# EAGLE design basisplatine (EAGLE 9.3.2)
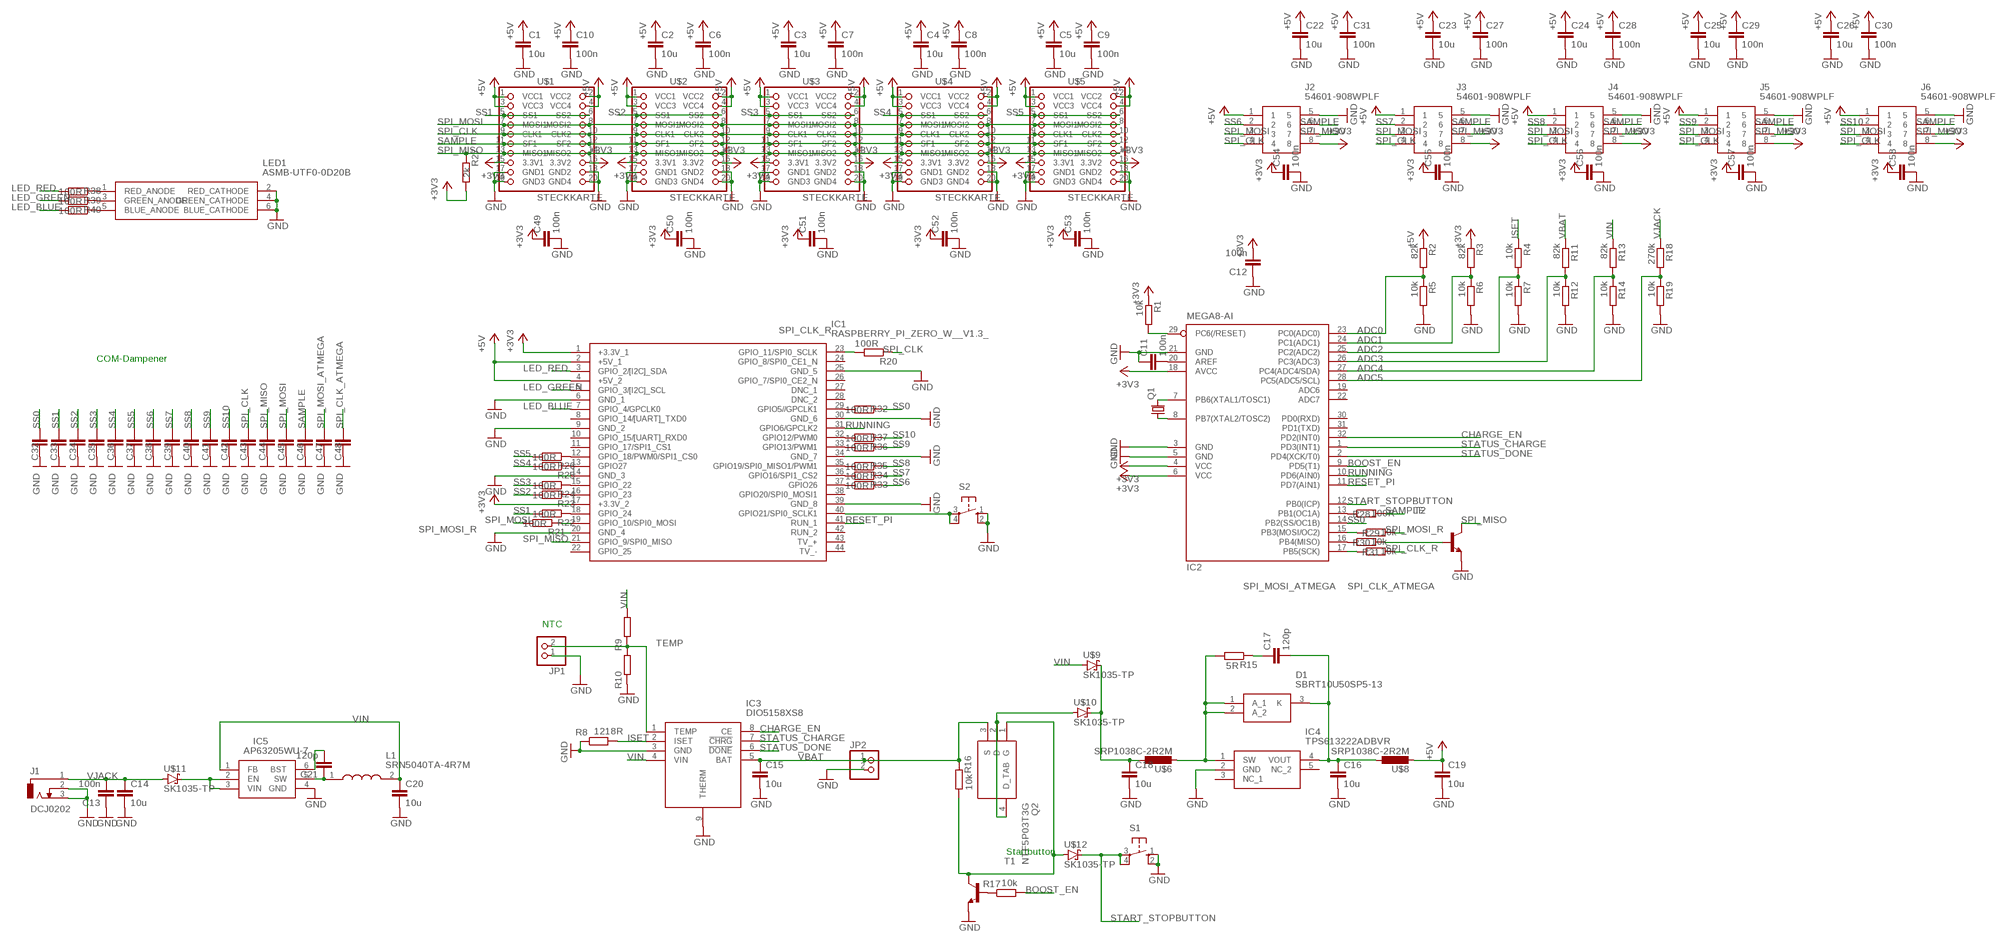
[diagram p0: schematic, sheet 1]

## Parts
C1  10u  C-EUC1206  [C1206]
C2  10u  C-EUC1206K  [C1206K]
C3  10u  C-EUC1206K  [C1206K]
C4  10u  C-EUC1206K  [C1206K]
C5  10u  C-EUC1206K  [C1206K]
C6  100n  C-EUC0603K  [C0603K]
C7  100n  C-EUC0603K  [C0603K]
C8  100n  C-EUC0603K  [C0603K]
C9  100n  C-EUC0603K  [C0603K]
C10  100n  C-EUC0603K  [C0603K]
C11  100n  C-EUC0603K  [C0603K]
C12  100n  C-EUC0603K  [C0603K]
C13  100n  C-EUC0603K  [C0603K]
C14  10u  C-EUC1206K  [C1206K]
C15  10u  C-EUC1206K  [C1206K]
C16  10u  C-EUC1206K  [C1206K]
C17  120p  C-EUC0603K  [C0603K]
C18  10u  C-EUC1206K  [C1206K]
C19  10u  C-EUC1206K  [C1206K]
C20  10u  C-EUC1206K  [C1206K]
C21  120p  C-EUC0603K  [C0603K]
C22  10u  C-EUC1206  [C1206]
C23  10u  C-EUC1206K  [C1206K]
C24  10u  C-EUC1206K  [C1206K]
C25  10u  C-EUC1206K  [C1206K]
C26  10u  C-EUC1206K  [C1206K]
C27  100n  C-EUC0603K  [C0603K]
C28  100n  C-EUC0603K  [C0603K]
C29  100n  C-EUC0603K  [C0603K]
C30  100n  C-EUC0603K  [C0603K]
C31  100n  C-EUC0603K  [C0603K]
C32  C-EUC0603K  [C0603K]
C33  C-EUC0603K  [C0603K]
C34  C-EUC0603K  [C0603K]
C35  C-EUC0603K  [C0603K]
C36  C-EUC0603K  [C0603K]
C37  C-EUC0603K  [C0603K]
C38  C-EUC0603K  [C0603K]
C39  C-EUC0603K  [C0603K]
C40  C-EUC0603K  [C0603K]
C41  C-EUC0603K  [C0603K]
C42  C-EUC0603K  [C0603K]
C43  C-EUC0603K  [C0603K]
C44  C-EUC0603K  [C0603K]
C45  C-EUC0603K  [C0603K]
C46  C-EUC0603K  [C0603K]
C47  C-EUC0603K  [C0603K]
C48  C-EUC0603K  [C0603K]
C49  100n  C-EUC0603K  [C0603K]
C50  100n  C-EUC0603K  [C0603K]
C51  100n  C-EUC0603K  [C0603K]
C52  100n  C-EUC0603K  [C0603K]
C53  100n  C-EUC0603K  [C0603K]
C54  100n  C-EUC0603K  [C0603K]
C55  100n  C-EUC0603K  [C0603K]
C56  100n  C-EUC0603K  [C0603K]
C57  100n  C-EUC0603K  [C0603K]
C58  100n  C-EUC0603K  [C0603K]
D1  SBRT10U50SP5-13  [SBRT10U50SP513]
IC1  RASPBERRY_PI_ZERO_W__V1.3_  [RASPBERRYPIZEROWV13]
IC2  MEGA8-AI  [TQFP32-08]
IC3  DIO5158XS8  [SOIC127P600X170-9N]
IC4  TPS613222ADBVR  [SOT95P280X145-5N]
IC5  AP63205WU-7  [SOT95P280X100-6N]
J1  DCJ0202  [DCJ0202]
J2  54601-908WPLF  [54601908WPLF]
J3  54601-908WPLF  [54601908WPLF]
J4  54601-908WPLF  [54601908WPLF]
J5  54601-908WPLF  [54601908WPLF]
J6  54601-908WPLF  [54601908WPLF]
JP1  PINHD-1X2  [1X02]
JP2  PINHD-1X2  [1X02]
L1  SRN5040TA-4R7M  [SRN5040TA4R7M]
LED1  ASMB-UTF0-0D20B  [ASMBUTF00D20B]
Q1  CRYSTALTC38H  [TC38H]
Q2  NTF5P03T3G  [SOT230P700X175-4N]
R1  10k  R-EU_R0603  [R0603]
R2  82k  R-EU_R0603  [R0603]
R3  82k  R-EU_R0603  [R0603]
R4  10k  R-EU_R0603  [R0603]
R5  10k  R-EU_R0603  [R0603]
R6  10k  R-EU_R0603  [R0603]
R7  10k  R-EU_R0603  [R0603]
R8  1218R  R-EU_R0603  [R0603]
R9  R-EU_R0603  [R0603]
R10  R-EU_R0603  [R0603]
R11  82k  R-EU_R0603  [R0603]
R12  10k  R-EU_R0603  [R0603]
R13  82k  R-EU_R0603  [R0603]
R14  10k  R-EU_R0603  [R0603]
R15  5R  R-EU_R0603  [R0603]
R16  10k  R-EU_R0603  [R0603]
R17  10k  R-EU_R0603  [R0603]
R18  270k  R-EU_R0603  [R0603]
R19  10k  R-EU_R0603  [R0603]
R20  100R  R-EU_R0603  [R0603]
R21  100R  R-EU_R0603  [R0603]
R22  100R  R-EU_R0603  [R0603]
R23  100R  R-EU_R0603  [R0603]
R24  100R  R-EU_R0603  [R0603]
R25  100R  R-EU_R0603  [R0603]
R26  100R  R-EU_R0603  [R0603]
R27  2k  R-EU_R0603  [R0603]
R28  100R  R-EU_R0603  [R0603]
R29  10k  R-EU_R0603  [R0603]
R30  10k  R-EU_R0603  [R0603]
R31  10k  R-EU_R0603  [R0603]
R32  100R  R-EU_R0603  [R0603]
R33  100R  R-EU_R0603  [R0603]
R34  100R  R-EU_R0603  [R0603]
R35  100R  R-EU_R0603  [R0603]
R36  100R  R-EU_R0603  [R0603]
R37  100R  R-EU_R0603  [R0603]
R38  100R  R-EU_R0603  [R0603]
R39  100R  R-EU_R0603  [R0603]
R40  100R  R-EU_R0603  [R0603]
S1  10-XX  [B3F-10XX]
S2  10-XX  [B3F-10XX]
T1  BC808-NPN-SOT23-BEC  [SOT23-BEC]
T2  BC808-NPN-SOT23-BEC  [SOT23-BEC]
U$1  STECKKARTE  [2X10]
U$2  STECKKARTE  [2X10]
U$3  STECKKARTE  [2X10]
U$4  STECKKARTE  [2X10]
U$5  STECKKARTE  [2X10]
U$6  SRP1038C-2R2M  [SRP1038C-2R2M]
U$8  SRP1038C-2R2M  [SRP1038C-2R2M]
U$9  SK1035-TP  [INDC2520X120N]
U$10  SK1035-TP  [INDC2520X120N]
U$11  SK1035-TP  [INDC2520X120N]
U$12  SK1035-TP  [INDC2520X120N]

## Nets
+3V3: C12.2 C49.1 C50.1 C51.1 C52.1 C53.1 C54.1 C55.1 C56.1 C57.1 C58.1 IC1.1(+3.3V_1) IC1.17(+3.3V_2) IC2.4(VCC) IC2.6(VCC) IC2.18(AVCC) J2.8 J3.8 J4.8 J5.8 J6.8 R1.1 R3.1 R27.2 U$1.15(3.3V1) U$1.16(3.3V2) U$2.15(3.3V1) U$2.16(3.3V2) U$3.15(3.3V1) U$3.16(3.3V2) U$4.15(3.3V1) U$4.16(3.3V2) U$5.15(3.3V1) U$5.16(3.3V2)
+5V: C1.1 C2.1 C3.1 C4.1 C5.1 C6.1 C7.1 C8.1 C9.1 C10.1 C19.1 C22.1 C23.1 C24.1 C25.1 C26.1 C27.1 C28.1 C29.1 C30.1 C31.1 IC1.2(+5V_1) IC1.4(+5V_2) J2.1 J3.1 J4.1 J5.1 J6.1 R2.1 U$1.1(VCC1) U$1.2(VCC2) U$1.3(VCC3) U$1.4(VCC4) U$2.1(VCC1) U$2.2(VCC2) U$2.3(VCC3) U$2.4(VCC4) U$3.1(VCC1) U$3.2(VCC2) U$3.3(VCC3) U$3.4(VCC4) U$4.1(VCC1) U$4.2(VCC2) U$4.3(VCC3) U$4.4(VCC4) U$5.1(VCC1) U$5.2(VCC2) U$5.3(VCC3) U$5.4(VCC4) U$8.P$2
ADC0: IC2.23(PC0(ADC0)) R2.2 R5.1
ADC1: IC2.24(PC1(ADC1)) R3.2 R6.1
ADC2: IC2.25(PC2(ADC2)) R4.2 R7.1
ADC3: IC2.26(PC3(ADC3)) R11.2 R12.1
ADC4: IC2.27(PC4(ADC4/SDA)) R13.2 R14.1
ADC5: IC2.28(PC5(ADC5/SCL)) R18.2 R19.1
BOOST_EN: IC2.9(PD5(T1)) R17.2
CHARGE_EN: IC2.32(PD2(INT0)) IC3.8(CE)
CLOCK_EN: IC2.29(PC6(/RESET)) R1.2
GND: C1.2 C2.2 C3.2 C4.2 C5.2 C6.2 C7.2 C8.2 C9.2 C10.2 C11.1 C12.1 C13.1 C14.2 C15.2 C16.2 C18.2 C19.2 C20.2 C22.2 C23.2 C24.2 C25.2 C26.2 C27.2 C28.2 C29.2 C30.2 C31.2 C32.1 C33.1 C34.1 C35.1 C36.1 C37.1 C38.1 C39.1 C40.1 C41.1 C42.1 C43.1 C44.1 C45.1 C46.1 C47.1 C48.1 C49.2 C50.2 C51.2 C52.2 C53.2 C54.2 C55.2 C56.2 C57.2 C58.2 IC1.6(GND_1) IC1.9(GND_2) IC1.14(GND_3) IC1.20(GND_4) IC1.25(GND_5) IC1.30(GND_6) IC1.34(GND_7) IC1.39(GND_8) IC2.3(GND) IC2.5(GND) IC2.21(GND) IC3.3(GND) IC3.9(THERM) IC4.2(GND) IC5.4(GND) J1.2 J1.3 J2.5 J3.5 J4.5 J5.5 J6.5 JP1.1 JP2.2 LED1.2(RED_CATHODE) LED1.4(GREEN_CATHODE) LED1.6(BLUE_CATHODE) R5.2 R6.2 R7.2 R8.1 R10.1 R12.2 R14.2 R19.2 S1.1(S) S1.2(S1) S2.1(S) S2.2(S1) T1.E T2.E U$1.17(GND1) U$1.18(GND2) U$1.19(GND3) U$1.20(GND4) U$2.17(GND1) U$2.18(GND2) U$2.19(GND3) U$2.20(GND4) U$3.17(GND1) U$3.18(GND2) U$3.19(GND3) U$3.20(GND4) U$4.17(GND1) U$4.18(GND2) U$4.19(GND3) U$4.20(GND4) U$5.17(GND1) U$5.18(GND2) U$5.19(GND3) U$5.20(GND4)
ISET: IC3.2(ISET) R4.1 R8.2
LED_BLUE: IC1.7(GPIO_4/GPCLK0) R40.2
LED_GREEN: IC1.5(GPIO_3/[I2C]_SCL) R39.2
LED_RED: IC1.3(GPIO_2/[I2C]_SDA) R38.2
N$1: D1.1(A_1) D1.2(A_2) IC4.1(SW) R15.2 U$6.P$2
N$2: C11.2 IC2.20(AREF)
N$3: IC2.7(PB6(XTAL1/TOSC1)) Q1.2
N$4: IC2.8(PB7(XTAL2/TOSC2)) Q1.1
N$5: IC5.2(EN) IC5.3(VIN) U$11.2(C)
N$6: C21.1 IC5.5(SW) L1.1
N$7: C17.1 R15.1
N$8: C16.1 C17.2 D1.3(K) IC4.4(VOUT) U$8.P$1
N$9: C18.1 U$6.P$1 U$9.2(C) U$10.2(C)
N$11: R17.1 T1.B
N$12: Q2.2(D) Q2.4(D_TAB) U$10.1(A)
N$13: C21.2 IC5.6(BST)
N$14: R30.2 T2.B
N$15: IC1.18(GPIO_24) R22.1
N$16: IC1.16(GPIO_23) R23.1
N$17: IC1.15(GPIO_22) R24.1
N$18: IC1.13(GPIO27) R25.1
N$19: IC1.12(GPIO_18/PWM0/SPI1_CS0) R26.1
N$20: IC2.13(PB1(OC1A)) R28.1
N$21: IC1.40(GPIO21/SPI0_SCLK1) S2.3(P) S2.4(P1)
N$22: IC2.16(PB4(MISO)) R30.1
N$23: Q2.1(G) R16.2 T1.C U$12.1(A)
N$24: IC1.29(GPIO5//GPCLK1) R32.2
N$25: IC1.32(GPIO12/PWM0) R37.2
N$26: IC1.33(GPIO13/PWM1) R36.2
N$27: IC1.35(GPIO19/SPI0_MISO1/PWM1) R35.2
N$28: IC1.36(GPIO16/SPI1_CS2) R34.2
N$29: IC1.37(GPIO26) R33.2
N$30: LED1.1(RED_ANODE) R38.1
N$31: LED1.3(GREEN_ANODE) R39.1
N$32: LED1.5(BLUE_ANODE) R40.1
RESET_PI: IC1.41(RUN_1) IC2.11(PD7(AIN1))
RUNNING: IC1.31(GPIO6/GPCLK2) IC2.10(PD6(AIN0))
SAMPLE: C46.2 J2.6 J3.6 J4.6 J5.6 J6.6 R28.2 U$1.11(SF1) U$1.12(SF2) U$2.11(SF1) U$2.12(SF2) U$3.11(SF1) U$3.12(SF2) U$4.11(SF1) U$4.12(SF2) U$5.11(SF1) U$5.12(SF2)
SPI_CLK: C43.2 J2.4 J3.4 J4.4 J5.4 J6.4 R20.1 U$1.9(CLK1) U$1.10(CLK2) U$2.9(CLK1) U$2.10(CLK2) U$3.9(CLK1) U$3.10(CLK2) U$4.9(CLK1) U$4.10(CLK2) U$5.9(CLK1) U$5.10(CLK2)
SPI_CLK_ATMEGA: C48.2 IC2.17(PB5(SCK)) R31.1
SPI_CLK_R: IC1.23(GPIO_11/SPI0_SCLK) R20.2 R31.2
SPI_MISO: C44.2 IC1.21(GPIO_9/SPI0_MISO) J2.7 J3.7 J4.7 J5.7 J6.7 R27.1 T2.C U$1.13(MISO1) U$1.14(MISO2) U$2.13(MISO1) U$2.14(MISO2) U$3.13(MISO1) U$3.14(MISO2) U$4.13(MISO1) U$4.14(MISO2) U$5.13(MISO1) U$5.14(MISO2)
SPI_MOSI: C45.2 J2.3 J3.3 J4.3 J5.3 J6.3 R21.2 U$1.7(MOSI1) U$1.8(MOSI2) U$2.7(MOSI1) U$2.8(MOSI2) U$3.7(MOSI1) U$3.8(MOSI2) U$4.7(MOSI1) U$4.8(MOSI2) U$5.7(MOSI1) U$5.8(MOSI2)
SPI_MOSI_ATMEGA: C47.2 IC2.15(PB3(MOSI/OC2)) R29.1
SPI_MOSI_R: IC1.19(GPIO_10/SPI0_MOSI) R21.1 R29.2
SS0: C32.2 IC2.14(PB2(SS/OC1B)) R32.1
SS1: C33.2 R22.2 U$1.5(SS1) U$1.6(SS2)
SS2: C34.2 R23.2 U$2.5(SS1) U$2.6(SS2)
SS3: C35.2 R24.2 U$3.5(SS1) U$3.6(SS2)
SS4: C36.2 R25.2 U$4.5(SS1) U$4.6(SS2)
SS5: C37.2 R26.2 U$5.5(SS1) U$5.6(SS2)
SS6: C38.2 J2.2 R33.1
SS7: C39.2 J3.2 R34.1
SS8: C40.2 J4.2 R35.1
SS9: C41.2 J5.2 R36.1
SS10: C42.2 J6.2 R37.1
START_STOPBUTTON: IC2.12(PB0(ICP)) S1.3(P) S1.4(P1) U$12.2(C)
STATUS_CHARGE: IC2.1(PD3(INT1)) IC3.7(!CHRG)
STATUS_DONE: IC2.2(PD4(XCK/T0)) IC3.6(!DONE)
TEMP: IC3.1(TEMP) JP1.2 R9.1 R10.2
VBAT: C15.1 IC3.5(BAT) JP2.1 Q2.3(S) R11.1 R16.1
VIN: C20.1 IC3.4(VIN) IC5.1(FB) L1.2 R9.2 R13.1 U$9.1(A)
VJACK: C13.2 C14.1 J1.1 R18.1 U$11.1(A)
Unconnected: IC1.8(GPIO_14/[UART]_TXD0) IC1.10(GPIO_15/[UART]_RXD0) IC1.11(GPIO_17/SPI1_CS1) IC1.22(GPIO_25) IC1.24(GPIO_8/SPI0_CE1_N) IC1.26(GPIO_7/SPI0_CE2_N) IC1.27(DNC_1) IC1.28(DNC_2) IC1.38(GPIO20/SPI0_MOSI1) IC1.42(RUN_2) IC1.43(TV_+) IC1.44(TV_-) IC2.19(ADC6) IC2.22(ADC7) IC2.30(PD0(RXD)) IC2.31(PD1(TXD)) IC4.3(NC_1) IC4.5(NC_2)

## Notes on the sheet
- COM-Dampener
- NTC
- Startbutton

## Library data of the parts
C1-C58 = rcl:C-EU: CAPACITOR, European symbol; SPICEPREFIX: C
D1 = basisplatine_lib:SBRT10U50SP5-13: Diodes Inc 50V 10A, Diode, 3-Pin PowerDI 5 SBRT10U50SP5-13 Source: Datasheet <https://componentsearchengine.com/Datasheets/1/SBRT10U50SP5-13.pdf>; DESCRIPTION: Diodes Inc 50V 10A, Diode, 3-Pin PowerDI 5 SBRT10U50SP5-13; HEIGHT: 1.15mm; MANUFACTURER_NAME: Diodes Inc.; MANUFACTURER_PART_NUMBER: SBRT10U50SP5-13; MOUSER_PART_NUMBER: 621-SBRT10U50SP5-13; MOUSER_PRICE-STOCK: https://www.mouser.com/Search/Refine.aspx?Keyword=621-SBRT10U50SP5-13
IC1 = basisplatine_lib:RASPBERRY_PI_ZERO_W__V1.3_: Raspberry Pi Zero W (v1.3) Single-board Computers Source: Datasheet <https://cdn.sparkfun.com/assets/learn_tutorials/6/7/6/PiZero_1.pdf>; DESCRIPTION: Raspberry Pi Zero W (v1.3) Single-board Computers; HEIGHT: mm; MANUFACTURER_NAME: RASPBERRY-PI; MANUFACTURER_PART_NUMBER: Raspberry Pi Zero W (v1.3)
IC2 = atmel:MEGA8: MICROCONTROLLER 8 Kbytes FLASH, 1 kbytes SRAM, 512 bytes EEPROM, USART, 6-channel 10 bit ADC, 2-channel 8 bit ADC Pin compatible with Atmega48, ATMega88, ATMega168 Source: avr.lbr; MPN: ATMEGA8-16AU; OC_FARNELL: 9171371; OC_NEWARK: 73M8863
IC3 = basisplatine_lib:DIO5158XS8: Battery Management 1A Lithium Ion Battery Charger IC Source: Datasheet <https://componentsearchengine.com/Datasheets/1/DIO5158XS8.pdf>; DESCRIPTION: Battery Management 1A Lithium Ion Battery Charger IC; HEIGHT: 1.7mm; MANUFACTURER_NAME: DIOO Microcircuits; MANUFACTURER_PART_NUMBER: DIO5158XS8; MOUSER_PART_NUMBER: 453-DIO5158XS8; MOUSER_PRICE-STOCK: https://www.mouser.com/Search/Refine.aspx?Keyword=453-DIO5158XS8
IC4 = basisplatine_lib:TPS613222ADBVR: 6-uA Quiescent Current, 1.8-A Switch Current Boost Converter Source: Datasheet <http://www.ti.com/lit/gpn/tps61322>; DESCRIPTION: 6-uA Quiescent Current, 1.8-A Switch Current Boost Converter; HEIGHT: 1.45mm; MANUFACTURER_NAME: Texas Instruments; MANUFACTURER_PART_NUMBER: TPS613222ADBVR; MOUSER_PART_NUMBER: 595-TPS613222ADBVR; MOUSER_PRICE-STOCK: https://www.mouser.com/Search/Refine.aspx?Keyword=595-TPS613222ADBVR
IC5 = basisplatine_lib:AP63205WU-7: Switching Voltage Regulators DCDC Conv HV Buck TSOT26 T&R 3K Source: Datasheet <https://componentsearchengine.com/Datasheets/1/AP63205WU-7.pdf>; DESCRIPTION: Switching Voltage Regulators DCDC Conv HV Buck TSOT26 T&R 3K; HEIGHT: 1mm; MANUFACTURER_NAME: Diodes Inc.; MANUFACTURER_PART_NUMBER: AP63205WU-7; MOUSER_PART_NUMBER: 621-AP63205WU-7; MOUSER_PRICE-STOCK: https://www.mouser.com/Search/Refine.aspx?Keyword=621-AP63205WU-7
J1 = con-jack:DCJ0202: DC POWER JACK Source: DCJ0202.pdf; OC_FARNELL: unknown; OC_NEWARK: unknown
J2-J6 = basisplatine_lib:54601-908WPLF: Modular Connectors / Ethernet Connectors 8P8C CAT 3 MOD JACK HORIZ. 1 PORT Source: Datasheet <https://www.amphenol-icc.com/media/wysiwyg/files/drawing/c-bmj-0051.pdf>; DESCRIPTION: Modular Connectors / Ethernet Connectors 8P8C CAT 3 MOD JACK HORIZ. 1 PORT; HEIGHT: 11.6mm; MANUFACTURER_NAME: Amphenol; MANUFACTURER_PART_NUMBER: 54601-908WPLF; MOUSER_PART_NUMBER: 649-54601-908WPLF; MOUSER_PRICE-STOCK: https://www.mouser.com/Search/Refine.aspx?Keyword=649-54601-908WPLF
JP1 JP2 = pinhead:PINHD-1X2: PIN HEADER
L1 = basisplatine_lib:SRN5040TA-4R7M: Inductor SMD 4.95x4.95x3.9mm 4.7uH 3.2A Source: Datasheet <https://componentsearchengine.com/Datasheets/1/SRN5040TA-4R7M.pdf>; DESCRIPTION: Inductor SMD 4.95x4.95x3.9mm 4.7uH 3.2A; HEIGHT: 4.1mm; MANUFACTURER_NAME: Bourns; MANUFACTURER_PART_NUMBER: SRN5040TA-4R7M; MOUSER_PART_NUMBER: 652-SRN5040TA-4R7M; MOUSER_PRICE-STOCK: https://www.mouser.com/Search/Refine.aspx?Keyword=652-SRN5040TA-4R7M
LED1 = basisplatine_lib:ASMB-UTF0-0D20B: Standard LEDs - SMD 2828 Tricolor PLCC6 LEDs Source: Datasheet <https://docs.broadcom.com/docs/ASMB-UTF0-0D20B-DS100>; DESCRIPTION: Standard LEDs - SMD 2828 Tricolor PLCC6 LEDs; HEIGHT: 2.6mm; MANUFACTURER_NAME: Avago Technologies; MANUFACTURER_PART_NUMBER: ASMB-UTF0-0D20B; MOUSER_PART_NUMBER: 630-ASMB-UTF0-0D20B; MOUSER_PRICE-STOCK: https://www.mouser.com/Search/Refine.aspx?Keyword=630-ASMB-UTF0-0D20B
Q1 = crystal:CRYSTAL: CRYSTAL; OC_FARNELL: unknown; OC_NEWARK: unknown
Q2 = basisplatine_lib:NTF5P03T3G: Power MOSFET Source: Datasheet <https://componentsearchengine.com/Datasheets/1/NTF5P03T3G.pdf>; DESCRIPTION: Power MOSFET; HEIGHT: 1.75mm; MANUFACTURER_NAME: ON Semiconductor; MANUFACTURER_PART_NUMBER: NTF5P03T3G; MOUSER_PART_NUMBER: 863-NTF5P03T3G; MOUSER_PRICE-STOCK: https://www.mouser.com/Search/Refine.aspx?Keyword=863-NTF5P03T3G
R1-R40 = rcl:R-EU_: RESISTOR, European symbol; SPICEPREFIX: R
S1 S2 = switch-omron:10-XX: OMRON SWITCH; MPN: B3F-1000; OC_FARNELL: 176432; OC_NEWARK: 36M3542
T1 T2 = transistor:*-NPN-: NPN Transistror BF959 corrected 2008.03.06
U$1-U$5 = basisplatine_lib:STECKKARTE
U$6 U$8 = basisplatine_lib:SRP1038C-2R2M
U$9-U$12 = basisplatine_lib:SK1035-TP

## Board
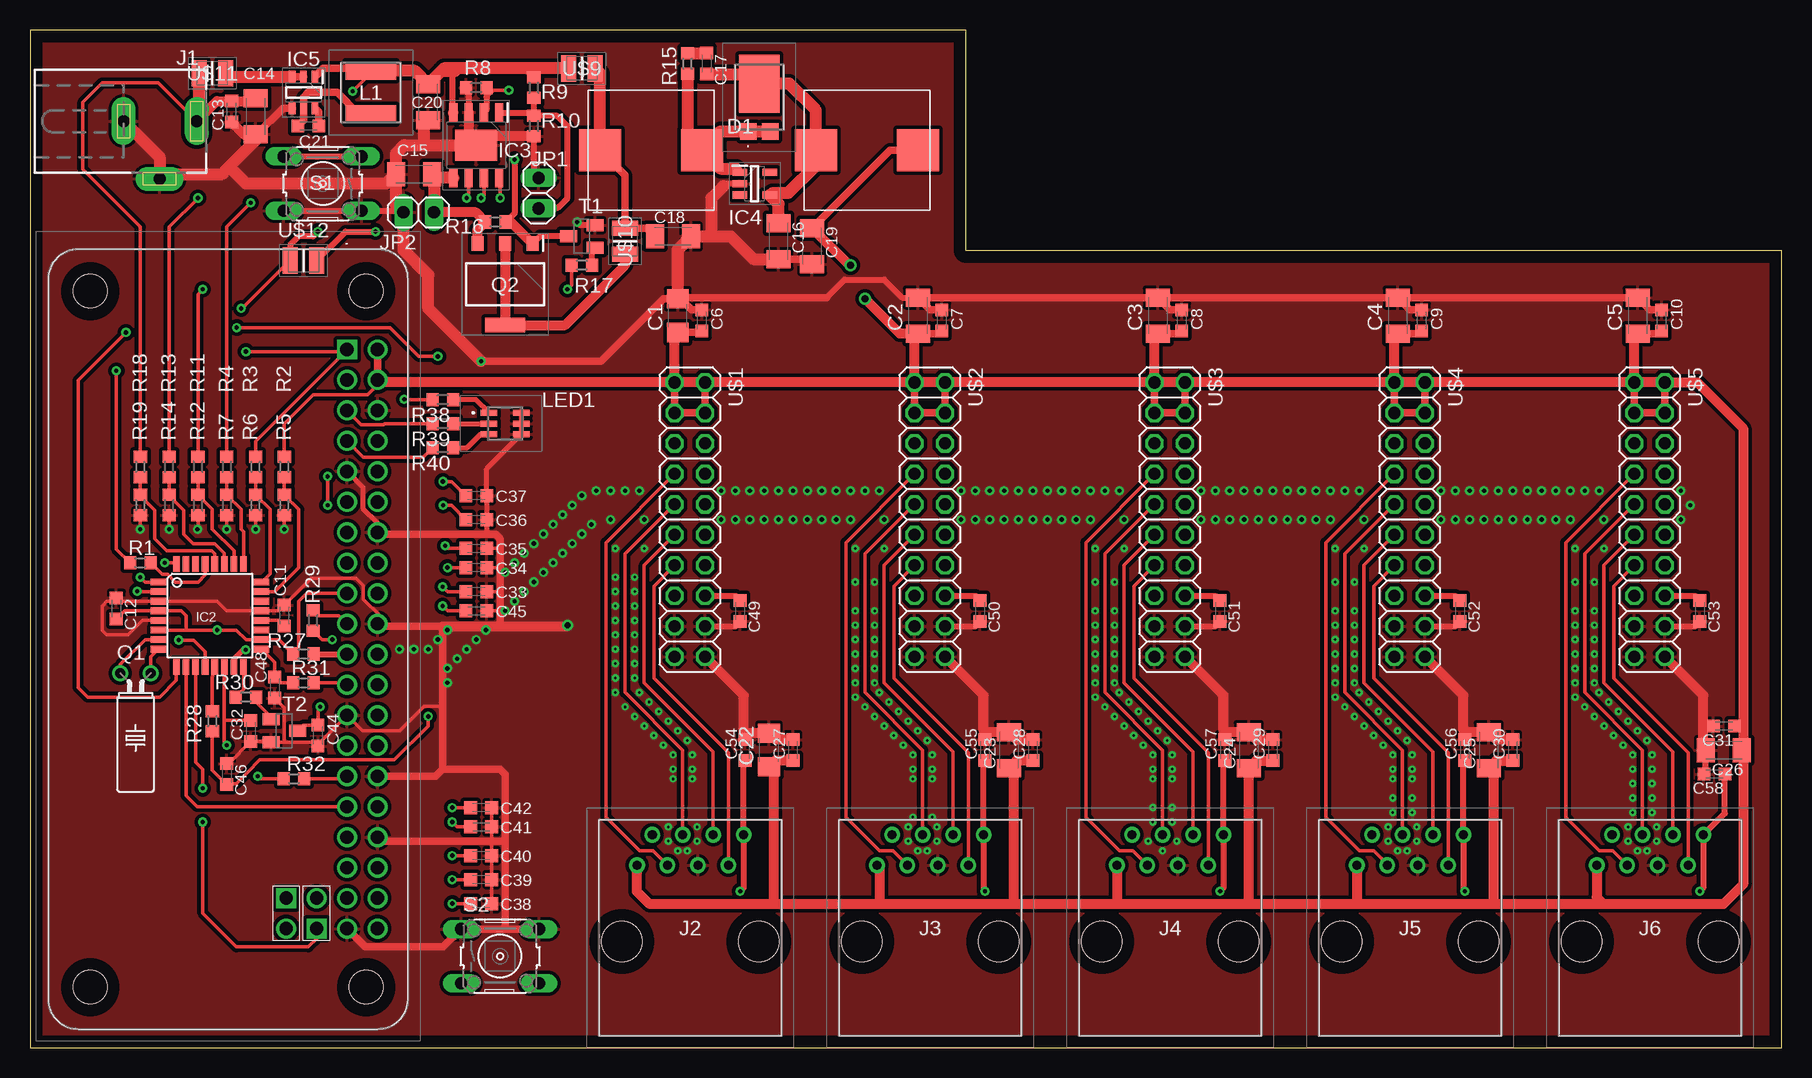
[diagram p1: board, top side]
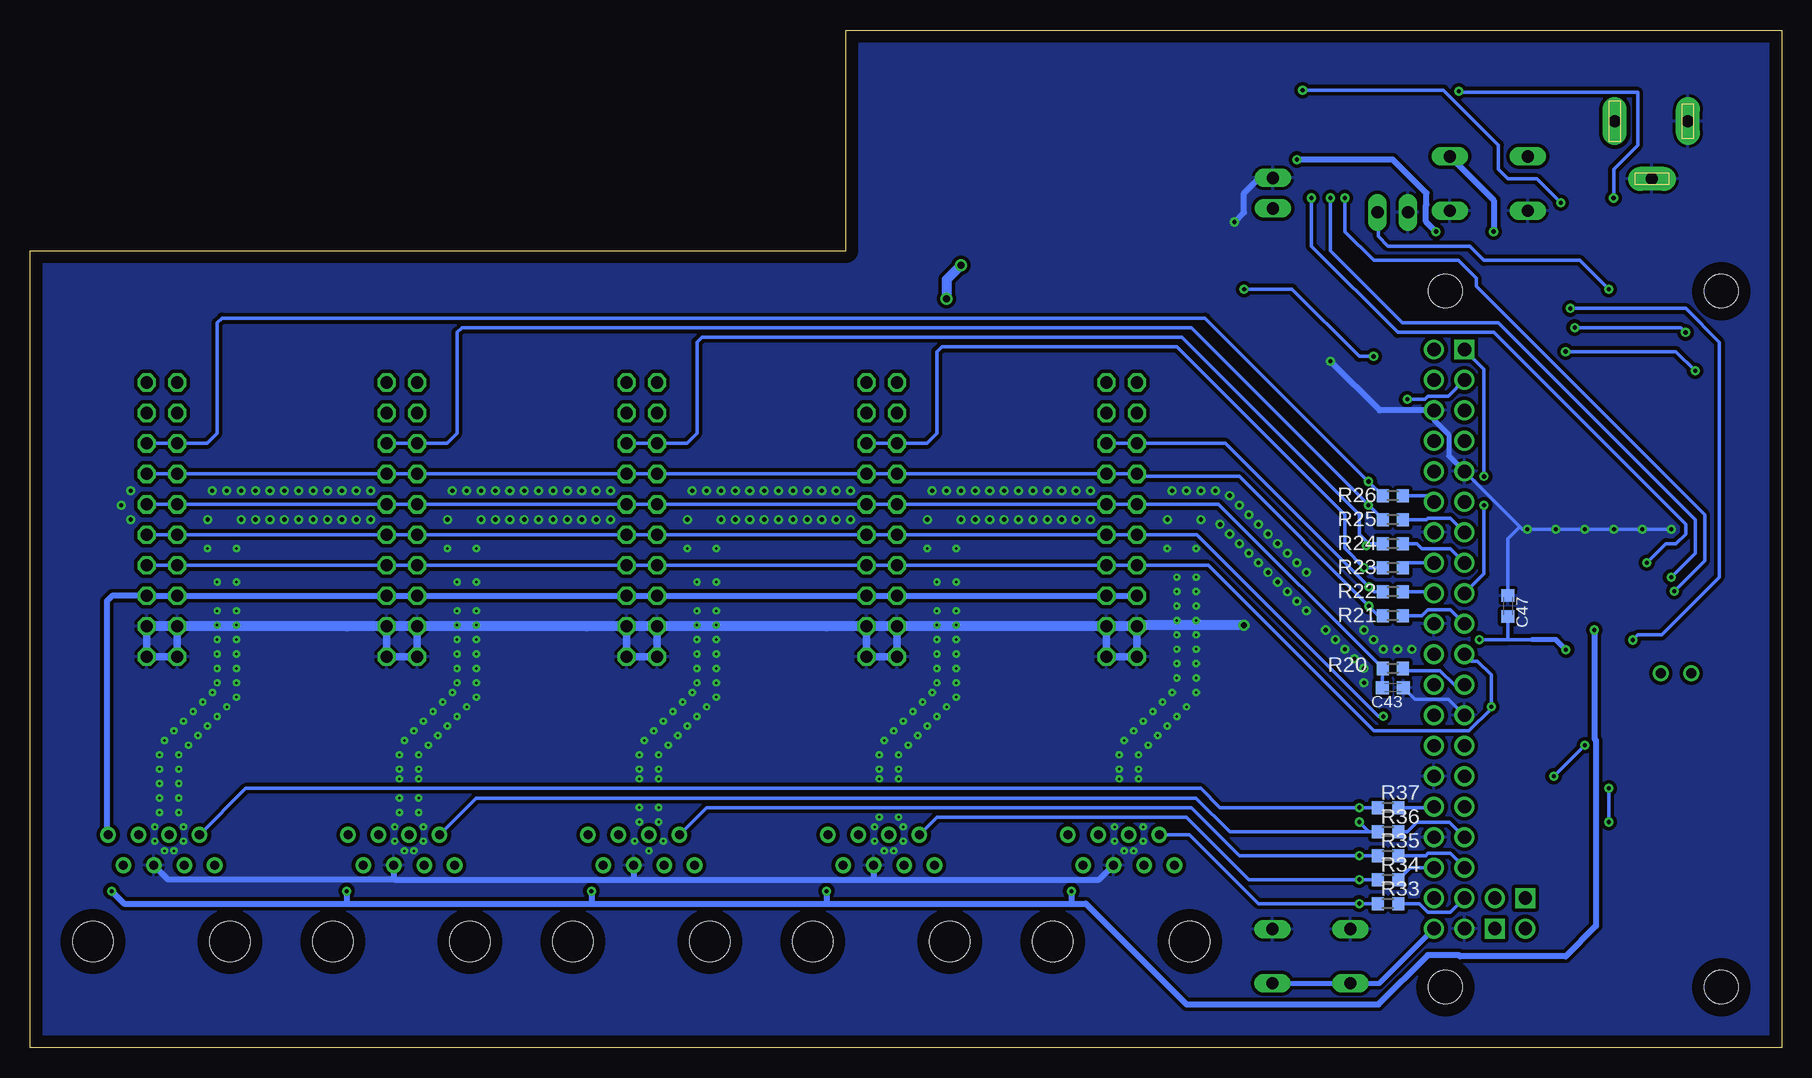
[diagram p2: board, bottom side, seen from below]

Size 146 x 84.8 mm. Coordinates in mm from the lower left corner, seen from the top.
Outline: 0,84.8 0,0 146,0 146,66.4 78,66.4 78,84.8 0,84.8
Copper layers (1*16): Top 0.035mm / dielectric 1.5mm / Bottom 0.035mm
Design rules "default *": minimum track width 6mil, minimum drill 0.2mm, track to track 12mil, track to pad 8mil, pad to pad 8mil, via to via 12mil, smd to smd 8mil, copper to edge 40mil, drill to drill 6mil, minimum pad ring 10mil, minimum via ring 8mil, stop-mask expansion 4mil, vias tented up to drill 0mil, thermal gap 10mil

### Footprints (pad centres in the part's own frame; a part is rotated, then mirrored left to right if it is on the bottom)
C1206 = smd 1.6 x 1.8: 1 -1.4,0; 2 1.4,0
C1206K = smd 1.5 x 2: 1 -1.5,0; 2 1.5,0
C0603K = smd 1.05 x 1.08: 1 -0.875,0; 2 0.875,0
SBRT10U50SP513 = smd 1.39 x 1.4: 1 -0.92,-2.856; 2 0.92,-2.856 | smd 3.36 x 4.86: 3 0,1.126
RASPBERRYPIZEROWV13 = drill 1.11 pad 1.665 square: 1 -23.885,9.92; 41 24.375,7.38; 43 21.835,4.84 | drill 1.11 pad 1.665: 2 -23.885,12.46; 3 -21.345,9.92; 4 -21.345,12.46; 5 -18.805,9.92; 6 -18.805,12.46; 7 -16.265,9.92; 8 -16.265,12.46; 9 -13.725,9.92; 10 -13.725,12.46; 11 -11.185,9.92; 12 -11.185,12.46; 13 -8.645,9.92; 14 -8.645,12.46; 15 -6.105,9.92; 16 -6.105,12.46; 17 -3.565,9.92; 18 -3.565,12.46; 19 -1.025,9.92; 20 -1.025,12.46; 21 1.515,9.92; 22 1.515,12.46; 23 4.055,9.92; 24 4.055,12.46; 25 6.595,9.92; 26 6.595,12.46; 27 9.135,9.92; 28 9.135,12.46; 29 11.675,9.92; 30 11.675,12.46; 31 14.215,9.92; 32 14.215,12.46; 33 16.755,9.92; 34 16.755,12.46; 35 19.295,9.92; 36 19.295,12.46; 37 21.835,9.92; 38 21.835,12.46; 39 24.375,9.92; 40 24.375,12.46; 42 21.835,7.38; 44 24.375,4.84 | hole 2.8: -28.755,11.5; -28.755,-11.5; 29.245,-11.5; 29.245,11.5
TQFP32-08 = smd 1.27 x 0.559: 1 -4.293,2.8; 2 -4.293,2; 3 -4.293,1.2; 4 -4.293,0.4; 5 -4.293,-0.4; 6 -4.293,-1.2; 7 -4.293,-2; 8 -4.293,-2.8; 17 4.293,-2.8; 18 4.293,-2; 19 4.293,-1.2; 20 4.293,-0.4; 21 4.293,0.4; 22 4.293,1.2; 23 4.293,2; 24 4.293,2.8 | smd 0.559 x 1.27: 9 -2.8,-4.293; 10 -2,-4.293; 11 -1.2,-4.293; 12 -0.4,-4.293; 13 0.4,-4.293; 14 1.2,-4.293; 15 2,-4.293; 16 2.8,-4.293; 25 2.8,4.293; 26 2,4.293; 27 1.2,4.293; 28 0.4,4.293; 29 -0.4,4.293; 30 -1.2,4.293; 31 -2,4.293; 32 -2.8,4.293
SOIC127P600X170-9N = smd 1.55 x 0.7: 1 -2.725,1.905; 2 -2.725,0.635; 3 -2.725,-0.635; 4 -2.725,-1.905; 5 2.725,-1.905; 6 2.725,-0.635; 7 2.725,0.635; 8 2.725,1.905 | smd 2.6 x 3.5: 9 0,0
SOT95P280X145-5N = smd 1.2 x 0.6: 1 -1.25,0.95; 2 -1.25,0; 3 -1.25,-0.95; 4 1.25,-0.95; 5 1.25,0.95
SOT95P280X100-6N = smd 1.05 x 0.55: 1 -1.3,0.95; 2 -1.3,0; 3 -1.3,-0.95; 4 1.3,-0.95; 5 1.3,0; 6 1.3,0.95
DCJ0202 = drill 1 pad 2 long: 1 0,3.1; 2 4.8,0; 3 0,-3
54601908WPLF = drill 0.76 pad 1.303: 1 0,0; 2 1.27,2.54; 3 2.54,0; 4 3.81,2.54; 5 5.08,0; 6 6.35,2.54; 7 7.62,0; 8 8.89,2.54 | hole 3.35: -1.271,-6.35; 10.161,-6.35
1X02 = drill 1.016 long: 1 -1.27,0; 2 1.27,0
SRN5040TA4R7M = smd 1.5 x 4.2: 1 -1.8,0; 2 1.8,0
ASMBUTF00D20B = smd 1.4 x 0.5: 1 -1.35,0.9; 2 1.35,0.9; 3 -1.35,0; 4 1.35,0; 5 -1.35,-0.9; 6 1.35,-0.9
TC38H = drill 0.813: 1 -1.27,0; 2 1.27,0
SOT230P700X175-4N = smd 1.2 x 1: 1 -3.4,2.3; 2 -3.4,0; 3 -3.4,-2.3 | smd 1.2 x 3.3: 4 3.4,0
R0603 = smd 1 x 1.1: 1 -0.85,0; 2 0.85,0
B3F-10XX = drill 1.016 long: 1 -3.251,2.261; 2 3.251,2.261; 3 -3.251,-2.261; 4 3.251,-2.261
SOT23-BEC = smd 1 x 1.4: B -0.95,-1.1; C 0,1.1; E 0.95,-1.1
2X10 = drill 1.016 octagon: 1 -11.43,-1.27; 2 -11.43,1.27; 3 -8.89,-1.27; 4 -8.89,1.27; 5 -6.35,-1.27; 6 -6.35,1.27; 7 -3.81,-1.27; 8 -3.81,1.27; 9 -1.27,-1.27; 10 -1.27,1.27; 11 1.27,-1.27; 12 1.27,1.27; 13 3.81,-1.27; 14 3.81,1.27; 15 6.35,-1.27; 16 6.35,1.27; 17 8.89,-1.27; 18 8.89,1.27; 19 11.43,-1.27; 20 11.43,1.27
SRP1038C-2R2M = smd 3.5 x 3.5: P$1 -4.5,0; P$2 4,0
INDC2520X120N = smd 1.25 x 2.2: 1 -1.1,0; 2 1.1,0

### Placement (x,y rotation side)
C1  54,61 90 top
C2  74,61 90 top
C3  94,61 90 top
C4  114,61 90 top
C5  134,61 90 top
C6  56,60.6 90 top
C7  76,60.6 90 top
C8  96,60.6 90 top
C9  116,60.6 90 top
C10  136,60.6 90 top
C11  21.2,36 270 top
C12  7.2,36.6 270 top
C13  16.8,78 90 top
C14  18.8,77.6 270 top
C15  32,72.8 180 top
C16  62.4,67.2 270 top
C17  56.4,82 270 top
C18  53.6,67.6 0 top
C19  65.2,66.8 270 top
C20  33.2,78.8 270 top
C21  23.2,76.8 0 top
C22  61.6,24.8 90 top
C23  81.6,24.8 90 top
C24  101.6,24.8 90 top
C25  121.6,24.8 90 top
C26  141.2,24.8 180 top
C27  63.6,24.8 90 top
C28  83.6,24.8 90 top
C29  103.6,24.8 90 top
C30  123.6,24.8 90 top
C31  141.2,26.8 180 top
C32  18.4,26.4 90 top
C33  37.2,38 180 top
C34  37.2,40 180 top
C35  37.2,41.6 180 top
C36  37.2,44 180 top
C37  37.2,46 180 top
C38  37.6,12 180 top
C39  37.6,14 180 top
C40  37.6,16 180 top
C41  37.6,18.4 180 top
C42  37.6,20 180 top
C43  32.4,30 180 bottom
C44  24,26 90 top
C45  37.2,36.4 180 top
C46  16.4,22.8 270 top
C47  22.8,36.8 270 bottom
C48  20.4,30 90 top
C49  59.2,36.4 270 top
C50  79.2,36.4 270 top
C51  99.2,36.4 270 top
C52  119.2,36.4 270 top
C53  139.2,36.4 270 top
C54  59.6,24.8 90 top
C55  79.6,24.8 90 top
C56  119.6,24.8 90 top
C57  99.6,24.8 90 top
C58  140.4,22.8 180 top
D1  60.8,79.2 0 top
IC1  16.51,34.29 270 top
IC2  15,36 0 top
IC3  37.2,75.2 270 top
IC4  60.4,72 0 top
IC5  22.8,79.6 270 top
J1  10.8,77.2 270 top
J2  50.6,15.2 0 top
J3  70.6,15.2 0 top
J4  90.6,15.2 0 top
J5  110.6,15.2 0 top
J6  130.6,15.2 0 top
JP1  42.4,71.2 270 top
JP2  32.4,69.6 180 top
L1  28.4,79.6 90 top
LED1  39.6,52 0 top
Q1  8.8,31.2 180 top
Q2  39.6,63.6 270 top
R1  9.2,40.4 0 top
R2  21.2,48.4 270 top
R3  18.8,48.4 270 top
R4  16.4,48.4 270 top
R5  21.2,45.2 270 top
R6  18.8,45.2 270 top
R7  16.4,45.2 270 top
R8  37.2,80 0 top
R9  42,80 90 top
R10  42,76.8 90 top
R11  14,48.4 270 top
R12  14,45.2 270 top
R13  11.6,48.4 270 top
R14  11.6,45.2 270 top
R15  54.8,82 270 top
R16  38.8,68.8 0 top
R17  46,65.2 180 top
R18  9.2,48.4 270 top
R19  9.2,45.2 270 top
R20  32.4,31.6 0 bottom
R21  32.4,36 180 bottom
R22  32.4,38 180 bottom
R23  32.4,40 180 bottom
R24  32.4,42 180 bottom
R25  32.4,44 180 bottom
R26  32.4,46 180 bottom
R27  22.8,32.8 180 top
R28  15.2,27.2 270 top
R29  23.6,35.6 90 top
R30  18,29.2 0 top
R31  22.8,30.4 0 top
R32  22,22.4 0 top
R33  32.8,12 0 bottom
R34  32.8,14 0 bottom
R35  32.8,16 0 bottom
R36  32.8,18 0 bottom
R37  32.8,20 0 bottom
R38  34.4,54 180 top
R39  34.4,52 180 top
R40  34.4,50 180 top
S1  24.4,72 180 top
S2  39.18,7.62 0 top
T1  46,67.6 90 top
T2  21.2,26.4 270 top
U$1  55,44 270 top
U$2  75,44 270 top
U$3  95,44 270 top
U$4  115,44 270 top
U$5  135,44 270 top
U$6  52,74.8 0 top
U$8  70,74.8 0 top
U$9  46,81.6 0 top
U$10  49.6,67.2 90 top
U$11  15.2,81.2 0 top
U$12  22.8,65.6 180 top

### Tracks (layer width: path | path; a pad name or v marks a point on that pad's centre or on a via)
+3V3  (via drill 0.35)
  Top 0.305: 13,34.8 IC2.6 | 13,34.8 13,36 12.6,36.4 IC2.4 7.88,36.4 C12.2 | 13,34.8 v15.6,34.8 17.2,34.8 18,34 IC2.18 20.75,34 R27.2 22.4,33.25 22.4,37.2 23.05,37.85 IC1.17 | IC1.1 26.25,58 | 26.25,58 18.8,50.55 R3.1 | v24.8,45.2 v24.8,47.6 | R1.1 7.2,41.55 v7.2,56.4 | v18,58 26.25,58
  Top 0.508: C58.1 141.28,19.52 J6.8 139.49,13.33 v139.2,13.04 | C56.1 119.49,23.82 J5.8 119.49,13.15 v119.6,13.04 | C57.1 99.49,23.82 J4.8 99.49,13.33 v99.2,13.04 | C55.1 79.49,23.82 J3.8 79.49,13.15 v79.6,13.04 | C54.1 59.49,23.82 J2.8 59.49,13.33 v59.2,13.04 | U$1.16 58.83,37.65 C49.1 | U$2.16 78.83,37.65 C50.1 | U$3.16 98.83,37.65 C51.1 | U$4.16 118.83,37.65 C52.1 | U$5.16 138.82,37.65 C53.1
  Bottom 0.305: IC1.17 24.8,39.48 v24.8,45.2 | v24.8,47.6 24.8,56.55 IC1.1 | v7.2,56.4 8.8,58 v18,58
  Bottom 0.508: U$1.15 U$1.16 U$2.15 U$2.16 U$3.15 U$3.16 U$4.15 U$4.16 U$5.15 U$5.16 139.15,37.65 139.6,37.2 139.6,17.85 J6.8 | v15.6,34.8 15.6,25.73 15.46,25.59 15.46,10.14 18,7.6 26.79,7.6 26.9,7.71 29.48,7.71 33.6,3.6 49.6,3.6 58,12 59.2,12 | v139.2,13.04 138.16,12 119.6,12 | 119.6,12 99.2,12 | 99.2,12 79.6,12 | 79.6,12 59.2,12 | v79.6,13.04 79.6,12 | v99.2,13.04 99.2,12 | v119.6,13.04 119.6,12 | v59.2,13.04 59.2,12
+5V  (via drill 0.6)
  Top 0.305: R2.1 21.2,52 23.6,54.4 28.14,54.4 29.18,55.43
  Top 0.61: U$1.2 U$1.4 U$1.3 U$1.1 | U$1.2 U$1.1 | U$2.2 U$2.4 U$2.3 U$2.1 | U$2.2 U$2.1 | 96.27,55.2 U$3.2 113.16,55.43 113.73,56 | 96.27,55.2 U$3.4 U$3.3 U$3.1 | U$3.1 96.04,55.43 96.27,55.2 | U$4.1 U$4.3 U$4.4 U$4.2 | U$4.1 U$4.2 | U$4.1 113.73,56 | 113.73,56 113.73,59.23 | U$5.1 U$5.3 U$5.4 U$5.2 U$5.1 | 133.85,59.35 C5.1 135.78,59.5 C10.1 | C8.1 95.78,59.5 C3.1 | U$1.2 U$2.1 | U$2.2 U$3.1 | U$4.2 U$5.1 | U$1.1 29.18,55.43 | IC1.2 IC1.4 | C7.1 75.78,59.5 C2.1 | C6.1 55.88,59.6 C1.1 | C4.1 115.78,59.5 C9.1 | C19.1 71.7,74.8 U$8.P$2
  Top 0.813: v69.6,62.4 72.5,59.5 C2.1 73.73,59.23 U$2.1 | C19.1 68.3,65.2 v68.4,65.2 | IC1.4 29.18,55.43 U$5.2 138.97,55.43 142.8,51.6 142.8,26.8 | U$5.1 133.73,59.23 133.85,59.35 | U$4.1 113.73,59.23 C4.1 | U$3.1 93.73,59.23 C3.1 | U$1.1 53.73,59.33 C1.1 | 142.8,26.8 142.8,24.8 | 142.8,24.8 142.8,13.6 141.15,11.95 131.2,11.95 | J2.1 50.6,13 51.65,11.95 62,11.95 | 131.2,11.95 122,11.95 | 122,11.95 110.8,11.95 | 110.8,11.95 101.6,11.95 | 101.6,11.95 90.8,11.95 | 90.8,11.95 82,11.95 | 82,11.95 70.8,11.95 | 70.8,11.95 62,11.95 | J3.1 70.8,15 70.8,11.95 | J4.1 90.6,12.15 90.8,11.95 | J5.1 110.6,12.15 110.8,11.95 | J6.1 130.6,12.55 131.2,11.95 | 62,11.95 62,23 C22.1 62.12,23.93 C27.1 | 82,11.95 82,22.9 C23.1 82.22,23.93 C28.1 | 101.6,11.95 C24.1 102.22,23.93 C29.1 | 122,11.95 122,22.9 C25.1 122.22,23.93 C30.1 | C26.1 142.8,24.8 | C31.1 142.8,26.8
  Bottom 0.813: v68.4,65.2 69.6,64 v69.6,62.4
ADC0
  Top 0.305: IC2.23 20.4,38 22.4,40 22.4,44.85 R5.1 R2.2
ADC1
  Top 0.305: IC2.24 20,39.51 20,44.85 R6.1 R3.2
ADC2
  Top 0.305: IC2.25 17.8,43 17.6,43.2 17.6,44.85 R7.1 R4.2
ADC3
  Top 0.305: IC2.26 17,41.4 15.2,43.2 15.2,44.85 R12.1 R11.2
ADC4
  Top 0.305: IC2.27 16.2,41.2 15.4,42 13.6,42 12.8,42.8 12.8,44.8 11.6,46 R14.1 R13.2
ADC5
  Top 0.305: IC2.28 15.4,41.14 15.15,41.39 11.41,41.39 10.4,42.4 10.4,44.8 9.2,46 R19.1 R18.2
BOOST_EN  (via drill 0.35)
  Top 0.305: IC2.9 12.2,30.6 10.8,29.2 4.8,29.2 4,30 4,55.6 v8,59.6 | v17.23,60 30,60 32.4,57.6 v34,57.6 | v44.8,63.2 45.15,63.55 R17.2
  Bottom 0.305: v8,59.6 8.4,60 v17.23,60 | v34,57.6 35.2,57.6 40.8,63.2 v44.8,63.2
CHARGE_EN  (via drill 0.35)
  Top 0.305: IC2.32 12.09,40.4 v11.23,40.4 | v39.2,70.8 39.2,72.38 IC3.8
  Bottom 0.305: v11.23,40.4 9.63,42 8.8,42 8,42.8 8,43.6 24,59.6 32,59.6 39.2,66.8 v39.2,70.8
CLOCK_EN
  Top 0.305: R1.2 11.02,39.44 11.49,39.44 12.12,38.8 14,38.8 14.6,39.4 IC2.29
GND  (via drill 0.2, 0.35, 0.5)
  Top 0.305: IC2.5 9.4,35.6 8.2,34.4 6.4,34.4 6,34.8 6,36.8 6.4,37.2 6.92,37.2 C12.1 7.47,37.2 IC2.3 15.6,37.2 16.4,36.4 IC2.21 20.73,36.4 C11.1 23.43,39.1 27.2,39.1 27.78,38.52 27.78,37.36 29.18,35.97 29.18,35.11 | R5.2 v21.2,43.2 | R6.2 v18.8,43.2 | R7.2 v16.4,43.2 | R12.2 14,43.21 v13.96,43.2 | R14.2 v11.6,43.2 | R19.2 v9.2,43.2 | 34.4,28.43 32.85,28.43 30.82,26.4 27.73,26.4 IC1.25 24.18,25.45 | 21.2,25.45 T2.E 20.02,25.52 C32.1 16.55,23.68 C46.1 | 21.2,25.45 24.18,25.45 | C44.1 24,25.27 24.18,25.45 | C48.1 21.2,28.32 21.2,25.45 | C33.1 39.2,38 | C34.1 39.2,40 | C35.1 39.2,41.6 | 38.08,42.8 C36.1 C37.1 | C42.1 C41.1 38.48,17.2 C40.1 C39.1 C38.1 | C45.1 39.2,36.4
  Top 0.406: IC1.9 27.73,46.71 27.73,44.96 28.97,43.72 IC1.14 | LED1.2 LED1.4 LED1.6 38.08,48.23 C37.1 38.08,42.8
  Top 0.508: JP1.1 42,72.87 R10.1 | R8.1 36.56,79.78 IC3.3 | T1.E 45.85,68.55 v45.6,68.8 | 66.4,62.5 67.9,64 71.2,64 72.7,62.5 73.6,62.5 | S1.2 S1.1 30.99,69.74 JP2.2 | C58.2 139.7,22.98 C26.2 | C56.2 119.6,26.29 119.49,26.4 | C57.2 99.6,26.29 99.59,26.3 | C55.2 79.6,26.29 79.59,26.3 | C54.2 59.6,26.29 59.49,26.4 | U$1.18 58.78,35.11 C49.2 | U$2.18 78.78,35.11 C50.2 | U$3.18 98.78,35.11 C51.2 | U$4.18 118.78,35.11 C52.2 | U$5.18 138.78,35.11 C53.2 | IC4.2 58,72 57.8,71.8
  Top 0.61: IC1.20 29.18,35.11 34.4,35.11 34.4,28.43 34.4,23.2 | IC1.14 29.11,42.8 38.08,42.8 38.8,42.8 39.2,42.4 39.2,41.6 39.2,40 39.2,38 39.2,36.4 39.2,35.11 | IC1.30 33.81,22.61 34.4,23.2 | 39.6,17.2 39.6,22.8 39.2,23.2 34.4,23.2 | 54.1,62.5 C1.2 52.8,62.4 47.6,57.2 v37.6,57.2 | 54.1,62.5 66.4,62.5 | 73.6,62.5 C2.2 | C2.2 C3.2 | C3.2 C4.2 | C4.2 C5.2 135.03,61.48 C10.2 | C9.2 115.03,61.48 C4.2 | C8.2 95.03,61.48 C3.2 | C7.2 75.03,61.48 C2.2 | C6.2 55.12,61.48 54.1,62.5 | IC5.4 21.1,78.3 18.9,76.1 C14.2 | C19.2 64.8,65.7 C16.2 | C18.2 54.1,66.6 54.1,62.5 | IC1.34 29.3,17.2 38.48,17.2 39.6,17.2 | S2.2 39.6,9.88 | 39.6,9.88 S2.1 34.45,8.4 27.95,8.4 IC1.39 | 39.6,17.2 39.6,9.88
  Top 0.813: C14.2 17.82,76.1 C13.1 | IC3.3 36.56,75.23 36.9,74.9 IC3.9 37.95,75.95 R10.1 | U$1.20 59.49,29.35 59.49,26.4 59.49,26 59.69,26.2 C22.2 62.12,25.68 C27.2 | 34.4,35.11 39.2,35.11 44.71,35.11 v44.8,35.2 | 139.49,26.8 139.49,24.8 C26.2 | 139.49,26.8 139.49,29.35 U$5.20 | U$4.20 119.49,29.35 119.49,26.4 119.59,26.3 C25.2 122.22,25.68 C30.2 | U$3.20 99.49,29.35 99.49,26.4 99.59,26.3 C24.2 102.22,25.68 C29.2 | U$2.20 79.49,29.35 79.49,26.4 79.59,26.3 C23.2 82.22,25.68 C28.2 | C31.2 139.49,26.8
  Top 1.016: v37.6,57.2 33.2,61.6 33.2,64.4 31.13,66.47 JP2.2 30.5,70.23 C15.2 | 32.8,75.2 31.2,75.2 30.5,74.5 C15.2 | 32.8,75.2 IC3.9 | J1.3 10.8,74.2 J1.2 11.2,72.8 16,72.8 16.4,73.2 | 16.4,73.2 18.8,75.6 C14.2 | C15.2 29.7,72 18,72 16.8,73.2 16.4,73.2 | C20.2 32.8,76.9 32.8,75.2 | 56.8,67.6 56.8,70.8 57.8,71.8 | 56.8,67.6 C18.2 54,66.5 C1.2 | 56.8,67.6 58.4,67.6 60.3,65.7 C16.2
  Bottom 0.305: 21.81,43.39 21.61,43.2 v21.2,43.2 v18.8,43.2 v16.4,43.2 v13.96,43.2 v11.6,43.2 v9.2,43.2 | 21.81,43.39 IC1.9 | C47.1 22.8,42.4 21.81,43.39 | C43.1 30.57,29.05 27.78,29.05 IC1.25
  Bottom 0.406: IC1.6 28.97,52.31 27.73,51.07 27.73,49.32 IC1.9
  Bottom 0.508: IC1.6 33.49,53.09 v37.6,57.2 | v45.6,68.8 44.8,69.6 44.8,71.2 43.53,72.47 JP1.1 | J2.5 56.88,14 75.6,14 | 115.6,14 95.6,14 | 95.6,14 75.6,14 | J3.5 75.68,14.08 75.6,14 | J4.5 95.68,14.08 95.6,14 | J5.5 115.68,14.08 115.6,14 | J6.5 134.48,14 115.6,14
  Bottom 0.61: U$5.17 U$5.19 U$5.20 U$5.18 U$5.17 | U$4.18 U$4.20 U$4.19 U$4.17 | U$4.17 U$4.18 | U$4.18 119.6,35.11 U$5.17 | U$3.18 U$3.17 | U$3.17 U$3.19 U$3.20 U$3.18 | U$3.18 99.6,35.11 U$4.17 | U$2.17 U$2.19 U$2.20 U$2.18 | U$2.18 79.6,35.11 U$3.17 | U$1.18 U$1.20 U$1.19 U$1.17 U$1.18 | U$1.18 U$2.17 | U$2.17 U$2.18
  Bottom 0.813: v44.8,35.2 53.64,35.2 U$1.17 79.6,35.11 99.6,35.11 119.6,35.11 U$5.18
  other vias: 34.8,31.6 35.6,32.4 36.4,33.2 37.2,34 38,34.8 40.4,37.2 39.6,36.4 41.2,38 42,38.8 42.8,39.6 43.6,40.4 44.4,41.2 45.2,42 46,42.8 46.8,43.6 51.2,44 48.4,44 57.6,44 58.8,44 60,44 61.2,44 62.4,44 63.6,44 64.8,44 66,44 67.2,44 68.4,44 71.2,44 77.6,44 78.8,44 80,44 81.2,44 82.4,44 83.6,44 84.8,44 86,44 87.2,44 88.4,44 91.2,44 97.6,44 98.8,44 100,44 101.2,44 102.4,44 103.6,44 104.8,44 106,44 107.2,44 108.4,44 111.2,44 117.6,44 118.8,44 120,44 121.2,44 122.4,44 123.6,44 124.8,44 126,44 127.2,44 128.4,44 131.2,44 137.6,44 138.4,45.2 137.6,46.4 126,46.4 129.6,46.4 127.2,46.4 128.4,46.4 130.8,46.4 124.8,46.4 123.6,46.4 122.4,46.4 121.2,46.4 120,46.4 118.8,46.4 117.6,46.4 110.8,46.4 108.4,46.4 109.6,46.4 107.2,46.4 106,46.4 104.8,46.4 103.6,46.4 102.4,46.4 101.2,46.4 100,46.4 98.8,46.4 97.6,46.4 88.4,46.4 89.6,46.4 90.8,46.4 87.2,46.4 86,46.4 84.8,46.4 83.6,46.4 82.4,46.4 81.2,46.4 80,46.4 78.8,46.4 77.6,46.4 68.4,46.4 69.6,46.4 70.8,46.4 67.2,46.4 66,46.4 64.8,46.4 63.6,46.4 62.4,46.4 61.2,46.4 60,46.4 58.8,46.4 57.6,46.4 48.4,46.4 49.6,46.4 50.8,46.4 47.2,46.4 45.2,45.2 46,46 44.4,44.4 43.6,43.6 42.8,42.8 42,42 41.2,41.2 40.4,40.4 39.6,39.6 34.8,34.8 34,34 33.2,33.2 32,33.2 30.8,33.2 34.8,30.4 128.8,41.6 130.4,38.8 130.4,36.4 128.8,38.8 128.8,36.4 131.2,41.6 128.8,35.2 130.4,35.2 130.4,34 130.4,32.8 128.8,32.8 128.8,34 128.8,31.6 130.4,31.6 130.4,30.4 128.8,30.4 128.8,29.2 129.6,28.4 130.8,29.6 131.6,28.8 132.4,28 133.2,27.2 134,26.4 134.8,25.6 130.4,27.6 131.2,26.8 132,26 132.8,25.2 135.2,24.4 133.6,24.4 133.6,23.2 135.2,23.2 135.2,22 133.6,22 133.6,20.8 135.2,20.8 135.2,19.6 133.6,19.6 133.2,18.4 133.2,17.2 134,16.4 134.8,16.4 135.6,17.2 135.6,18.4 108.8,41.6 111.2,41.6 108.8,38.8 110.4,38.8 110.4,36.4 108.8,36.4 108.8,35.2 108.8,34 108.8,32.8 110.4,34 110.4,35.2 110.4,32.8 110.4,31.6 110.4,30.4 110.8,29.6 111.6,28.8 112.4,28 113.2,27.2 114,26.4 114.8,25.6 108.8,31.6 108.8,30.4 108.8,29.2 109.6,28.4 110.4,27.6 111.2,26.8 112,26 112.8,25.2 113.6,24.4 115.2,24.4 115.2,22.4 113.6,23.2 115.2,23.2 113.6,22.4 113.6,20.8 115.2,20.8 115.2,19.6 115.6,18.4 115.6,17.2 114.8,16.4 114,16.4 113.2,17.2 113.2,18.4 113.6,19.6 91.2,41.6 88.8,41.6 88.8,38.8 90.4,38.8 90.4,36.4 88.8,36.4 88.8,35.2 90.4,35.2 90.4,34 88.8,34 88.8,32.8 90.4,32.8 88.8,31.6 90.4,31.6 90.4,30.4 88.8,30.4 90.8,29.6 88.8,29.2 89.6,28.4 91.6,28.8 92.4,28 93.2,27.2 90.4,27.6 91.2,26.8 92,26 92.8,25.2 94,26.4 94.8,25.6 93.6,24.4 95.2,24.4 95.2,23.2 93.6,23.2 93.6,22.4 95.2,22.4 95.2,20 93.6,20 93.6,18.8 95.2,18.8 95.6,17.2 93.2,17.2 94.4,16.4 71.2,41.6 68.8,41.6 68.8,38.8 70.4,38.8 70.4,36.4 68.8,36.4 68.8,35.2 70.4,35.2 70.4,34 68.8,34 68.8,32.8 70.4,32.8 70.4,31.6 68.8,31.6 68.8,30.4 70.4,30.4 68.8,29.2 70.8,29.6 69.6,28.4 70.4,27.6 71.6,28.8 72.4,28 73.2,27.2 74,26.4 74.8,25.6 71.2,26.8 72,26 72.8,25.2 73.6,24.4 75.2,24.4 75.2,23.2 73.6,23.2 73.6,22.4 75.2,22.4 73.6,19.2 75.2,19.2 75.6,18.4 73.2,18.4 73.2,17.2 75.6,17.2 74.8,16.4 74,16.4 51.2,41.6 48.8,41.6 48.8,39.2 50.4,39.2 50.4,38 48.8,38 48.8,36.8 50.4,36.8 50.4,35.6 48.8,35.6 48.8,34.4 50.4,34.4 48.8,33.2 50.4,33.2 50.4,32 48.8,32 48.8,30.8 50.4,30.8 48.8,29.6 49.6,28.4 50.8,29.6 51.6,28.8 52.4,28 53.2,27.2 54,26.4 54.8,25.6 50.4,27.6 51.2,26.8 52,26 52.8,25.2 53.6,24.4 55.2,24.4 55.2,23.2 55.2,22.4 53.6,23.2 53.6,22.4 53.2,18.4 55.6,18.4 55.6,17.2 53.2,17.2 54,16.4 54.8,16.4
  pour Top: 0,0 146,0 146,84.8 0,84.8
  pour Bottom: 0,0 146,0 146,84.8 0,84.8
ISET  (via drill 0.35)
  Top 0.305: R4.1 16.4,68.4 v18.4,70.4 | v39.92,79.78 38.63,79.78 38.05,79.2
  Top 0.508: R8.2 38.05,79.2 38.05,78.14 IC3.2
  Bottom 0.305: v18.4,70.4 20.4,72.4 22.8,72.4 23.6,73.2 23.6,75.2 28.18,79.78 v39.92,79.78
LED_BLUE
  Top 0.305: IC1.7 27.78,49.2 29.46,49.2 32.75,49.2 R40.2
LED_GREEN
  Top 0.305: R39.2 29.55,52 29.46,51.91 27.62,51.91 IC1.5
LED_RED  (via drill 0.35)
  Top 0.305: v31.2,54.03 31.23,54 R38.2
  Bottom 0.305: v31.2,54.03 29.71,54.03 29.46,54.28 27.78,54.28 IC1.3
N$1
  Top 0.61: 58.85,73.25 IC4.1
  Top 1.016: U$6.P$2 57.54,76.34 D1.1 D1.2 | U$6.P$2 57.55,73.25 58.85,73.25 | R15.2 54.8,76 U$6.P$2
N$2
  Top 0.305: IC2.20 20.73,35.6 C11.2
N$3
  Top 0.305: IC2.7 9.6,34 7.53,31.93 Q1.2
N$4
  Top 0.305: Q1.1 10.07,32.56 IC2.8
N$5
  Top 0.61: IC5.3 IC5.2
  Top 1.016: U$11.2 16.6,80.9 IC5.3
N$6
  Top 0.61: C21.1 22.8,77.28 IC5.5 22.8,79.2 23.2,79.6 25.6,79.6 27.4,77.8 L1.1
N$7
  Top 1.016: R15.1 56.38,82.85 C17.1
N$8
  Top 0.61: 61.75,71.05 IC4.4
  Top 1.016: 61.75,71.05 61.9,71.2 63.2,71.2 65.5,73.5 U$8.P$1 65.5,78.1 63.27,80.33 D1.3 60,81.12 C17.2 | C16.1 62.4,70.3 IC4.4
N$9
  Top 0.61: U$6.P$1 49.6,72.7 U$10.2 51.4,68.3 C18.1
  Top 1.016: U$6.P$1 47.5,81.2 U$9.2
N$11
  Top 0.508: R17.1 46.85,66.4 T1.B
N$12
  Top 0.813: Q2.2 Q2.4 44.6,60.2 49.6,65.2 U$10.1
N$13
  Top 0.61: IC5.6 24.07,77.97 C21.2
N$14
  Top 0.305: T2.B 20.1,27.55 18.85,28.8 R30.2
N$15
  Bottom 0.305: R22.1 29.11,38 IC1.18
N$16
  Bottom 0.305: IC1.16 31.16,40.4 R23.1
N$17
  Bottom 0.305: R24.1 30.4,42 29.98,41.58 27.62,41.58 IC1.15
N$18
  Bottom 0.305: R25.1 29.59,44 29.46,44.12 27.62,44.12 IC1.13
N$19
  Bottom 0.305: R26.1 29.5,46 IC1.12
N$20
  Top 0.305: R28.1 15.2,30.89 15.23,30.93 15.23,31.54 IC2.13
N$21
  Bottom 0.406: S2.4 S2.3 33.53,5.36 IC1.40
N$22
  Top 0.305: R30.1 17.8,29.85 IC2.16
N$23  (via drill 0.35)
  Top 0.508: T1.C 42.5,67.6 Q2.1 | U$12.1 26.3,68 v28.8,68 | v40.4,74 40.4,69.55 R16.2
  Top 0.813: R16.2 40.1,68.8 Q2.1
  Bottom 0.508: v28.8,68 29.63,68.83 29.63,70.24 29.6,70.28 29.6,71.2 32.4,74 v40.4,74
N$24
  Top 0.305: IC1.29 26.21,22.4 R32.2
N$25
  Bottom 0.305: R37.2 29.05,20 IC1.32
N$26
  Bottom 0.305: IC1.33 27.7,18.8 30.4,18.8 31.2,18 R36.2
N$27
  Bottom 0.305: R35.2 29.64,16 29.46,16.18 27.62,16.18 IC1.35
N$28
  Bottom 0.305: IC1.36 30.95,14.99 R34.2
N$29
  Bottom 0.305: R33.2 30.2,12 29.46,11.27 27.62,11.27 IC1.37
N$30
  Top 0.406: LED1.1 37.15,54 R38.1
N$31
  Top 0.406: R39.1 LED1.3
N$32
  Top 0.406: R40.1 36.45,50 37.55,51.1 LED1.5
RESET_PI  (via drill 0.35)
  Top 0.305: IC1.41 23.89,9.09 23.2,8.4 17.2,8.4 14.4,11.2 v14.4,18.8 | v14.4,21.6 14.4,23.2 13.8,23.8 IC2.11
  Bottom 0.305: v14.4,18.8 v14.4,21.6
RUNNING
  Top 0.305: IC2.10 13,21 13.93,20.07 IC1.31
SAMPLE  (via drill 0.35)
  Top 0.305: v33.2,27.6 33.2,26.8 30.37,23.97 19.16,23.97 18.15,22.96 18.15,22.95 17.2,22 16.48,22 C46.2 15.2,23.12 R28.2 | J2.6 56.95,24.65 51.2,30.4 51.2,40.2 U$1.11 | J3.6 76.95,24.65 71.2,30.4 71.2,40.2 U$2.11 | J4.6 96.95,24.65 91.2,30.4 91.2,40.2 U$3.11 | J5.6 116.95,24.65 111.2,30.4 111.2,40.2 U$4.11 | J6.6 136.95,24.65 131.2,30.4 131.2,40.2 U$5.11
  Bottom 0.305: U$5.12 U$5.11 U$4.12 U$4.11 U$3.12 U$3.11 U$2.12 U$2.11 U$1.12 U$1.11 48.73,42.73 33.6,27.6 v33.2,27.6
SPI_CLK
  Top 0.305: J2.4 54.41,24.79 49.6,29.6 49.6,41.14 U$1.9 | J3.4 74.4,24.8 69.6,29.6 69.6,41.14 U$2.9 | J4.4 94.41,24.79 89.6,29.6 89.6,41.14 U$3.9 | J5.4 114.41,24.79 109.6,29.6 109.6,41.14 U$4.9 | J6.4 134.41,24.79 129.6,29.6 129.6,41.14 U$5.9
  Bottom 0.305: U$5.10 U$5.9 U$4.10 U$4.9 U$3.10 U$3.9 U$2.10 U$2.9 U$1.10 U$1.9 46.92,45.27 R20.1 33.27,31.57 C43.2
SPI_CLK_ATMEGA
  Top 0.305: R31.1 20.88,30.4 C48.2 20.4,32.09 IC2.17
SPI_CLK_R
  Top 0.305: IC1.23 26.27,30.4 R31.2
  Bottom 0.305: IC1.23 27.29,30.23 28.48,31.42 31.37,31.42 R20.2
SPI_MISO  (via drill 0.35)
  Top 0.305: J2.7 58.22,24.58 52,30.8 52,38.46 U$1.13 | J3.7 78.22,24.58 72,30.8 72,38.46 U$2.13 | J4.7 98.22,24.58 92,30.8 92,38.46 U$3.13 | J5.7 118.22,24.58 112,30.8 112,38.46 U$4.13 | J6.7 138.22,24.58 132,30.8 132,38.46 U$5.13 | T2.C 22.77,26.88 C44.2 24,28.21 v24.19,28.4
  Top 0.508: R27.1 26.41,32.8 IC1.21
  Bottom 0.305: U$5.14 U$5.13 U$4.14 U$4.13 U$3.14 U$3.13 U$2.14 U$2.13 U$1.14 U$1.13 47.79,40.19 34,26.4 26.05,26.4 24.19,28.25 v24.19,28.4 24.19,31.05 25.35,32.21 25.86,32.21 IC1.21
SPI_MOSI  (via drill 0.35)
  Top 0.305: J2.3 51.94,16.4 50.8,16.4 48,19.2 48,42.08 U$1.7 | J3.3 71.94,16.4 70.8,16.4 68,19.2 68,42.08 U$2.7 | J4.3 91.94,16.4 90.8,16.4 88,19.2 88,42.08 U$3.7 | J5.3 113.14,15.26 112,16.4 110.8,16.4 108,19.2 108,42.08 U$4.7 | J6.3 131.94,16.4 130.8,16.4 128,19.2 128,42.08 U$5.7 | C45.2 34.8,36.4 v34.4,36.8
  Bottom 0.305: U$1.7 54,47.81 | 54,47.81 U$1.8 U$2.7 U$2.8 U$3.7 U$3.8 U$4.7 U$4.8 U$5.7 U$5.8 | 54,47.81 53.79,47.6 45.2,47.6 v34.4,36.8 33.6,36 R21.2
SPI_MOSI_ATMEGA  (via drill 0.35)
  Top 0.305: R29.1 24.35,34 v25.2,34 | IC2.15 17,32.4
  Top 0.406: 17,32.4 17.77,33.16 v17.98,33.16
  Bottom 0.305: v25.2,34 22.8,34 | 20.8,34 22.8,34 | C47.2 22.8,34
  Bottom 0.406: v17.98,33.16 18.81,34 20.8,34
SPI_MOSI_R
  Top 0.305: R29.2 24.05,36 25.75,36 IC1.19
  Bottom 0.305: R21.1 29.96,36 29.46,36.5 27.62,36.5 IC1.19
SS0  (via drill 0.35)
  Top 0.305: IC2.14 16.2,27.2 | 16.2,27.2 16.2,25.4 v16.4,25.2 | R32.1 19.2,22.4 v18.98,22.61 | C32.2 16.27,27.27 16.2,27.2
  Bottom 0.305: v16.4,25.2 v18.98,22.61
SS1  (via drill 0.35)
  Top 0.305: C33.2 34.8,38 v34.4,38.4
  Bottom 0.305: U$1.6 U$1.5 46.35,50.35 v34.4,38.4 34,38 R22.2
SS2  (via drill 0.35)
  Top 0.305: C34.2 v34.8,40
  Bottom 0.305: U$2.6 U$2.5 71.25,50.35 70.4,51.2 70.4,58 70,58.4 50.4,58.4 36.4,44.4 36.4,41.6 v34.8,40 R23.2
SS3  (via drill 0.35)
  Top 0.305: C35.2 34.81,41.6 v34.6,41.81
  Bottom 0.305: U$3.6 U$3.5 91.25,50.35 90.4,51.2 90.4,58.8 90,59.2 50,59.2 42.4,51.6 35.2,44.4 35.2,42.8 34.4,42 | R24.2 34.4,42 | v34.6,41.81 34.41,42 34.4,42
SS4  (via drill 0.35)
  Top 0.305: C36.2 35.12,45.2 v34.43,45.2
  Bottom 0.305: U$4.6 U$4.5 111.25,50.35 110.4,51.2 110.4,59.6 110,60 49.2,60 34.4,45.2 | R25.2 33.25,44.05 34,44.8 34.4,45.2 | v34.43,45.2 34.4,45.2
SS5  (via drill 0.35)
  Top 0.305: C37.2 35.15,47.17 v34.42,47.17
  Bottom 0.305: U$5.6 U$5.5 131.25,50.35 130.4,51.2 130.4,60.4 130,60.8 48.05,60.8 v34.42,47.17 R26.2
SS6  (via drill 0.35)
  Top 0.305: C38.2 v35.2,12
  Bottom 0.305: J2.2 49.34,17.74 43.6,12 v35.2,12 R33.1
SS7  (via drill 0.35)
  Top 0.305: C39.2 v35.2,14
  Bottom 0.305: J3.2 70.41,19.2 49.6,19.2 44.4,14 v35.2,14 R34.1
SS8  (via drill 0.35)
  Top 0.305: C40.2 v35.2,16
  Bottom 0.305: J4.2 89.61,20 49.2,20 45.2,16 v35.2,16 R35.1
SS9  (via drill 0.35)
  Top 0.305: C41.2 35.6,18.4 v35.2,18.8
  Bottom 0.305: J5.2 108.81,20.8 48.8,20.8 46,18 34.4,18 | R36.1 34,18 34.4,18 | v35.2,18.8 34.4,18
SS10  (via drill 0.35)
  Top 0.305: C42.2 v35.2,20
  Bottom 0.305: J6.2 128.01,21.6 48.4,21.6 46.8,20 v35.2,20 R37.1
START_STOPBUTTON  (via drill 0.35)
  Top 0.305: U$12.2 17.7,61.6 v17.6,61.6 | IC2.12 14.6,33 13.63,33.97 v12.4,33.97
  Top 0.508: S1.4 S1.3 | v24,68 23.6,67.6 22.4,67.6 21.7,66.9 U$12.2
  Bottom 0.305: v17.6,61.6 8,61.6 5.2,58.8 5.2,39.2 10,34.4 11.96,34.4 v12.4,33.97
  Bottom 0.508: S1.3 24,70.61 v24,68
STATUS_CHARGE  (via drill 0.35)
  Top 0.305: IC2.1 9.6,38.8 v9.2,39.2 | IC3.7 37.84,71.03 v37.6,70.8
  Bottom 0.305: v9.2,39.2 7.2,41.2 7.2,44 23.6,60.4 31.6,60.4 37.6,66.4 v37.6,70.8
STATUS_DONE  (via drill 0.35)
  Top 0.305: IC2.2 8.98,38 v8.94,38.03 | v36.4,70.8 36.56,70.97 IC3.6
  Bottom 0.305: v8.94,38.03 6.4,40.58 6.4,44.4 23,61 23.6,61.6 25.44,63.44 25.44,64.11 26.95,65.61 29.07,65.61 29.09,65.6 34,65.6 36.4,68 v36.4,70.8
TEMP
  Top 0.508: JP1.2 42.47,70 44,70 44.8,70.8 44.8,76.8 43.95,77.65 R10.2 | R10.2 R9.1 | IC3.1 41.73,77.92 R10.2
VBAT  (via drill 0.35)
  Top 0.305: R11.1 14,62.8 v14.4,63.2
  Top 0.813: JP2.1 37.15,69.6 R16.1 37.3,68.15 Q2.3
  Top 1.016: JP2.1 33.67,72.63 C15.1 33.83,72.47 IC3.5
  Bottom 0.305: v14.4,63.2 16.8,65.6 24.8,65.6 26,66.8 32.8,66.8 33.6,67.6 33.6,69.67
  Bottom 0.508: 33.6,69.67 JP2.1
VIN  (via drill 0.35)
  Top 0.305: R13.1 11.6,68.4 v14,70.8 | v26.9,79.7 28.4,81.2 L1.2
  Top 0.508: R9.2 41.95,80.85 41.2,81.6 35.6,81.6 | 35.4,81.4 35.2,81.2 35.2,77.97 35.27,77.9
  Top 0.61: IC5.1 24.45,81.6 28.2,81.6 L1.2 | U$9.1 35.6,81.6 35.4,81.4
  Top 0.813: 35.27,77.9 IC3.4
  Top 1.016: L1.2 32.1,81.4 C20.1 34.3,81.4 | 34.3,81.4 35.4,81.4 | U$9.1 34.5,81.6 34.3,81.4
  Bottom 0.305: v14,70.8 14,73.2 12,75.2 12,79.6 26.8,79.6 v26.9,79.7
VJACK
  Top 0.305: R18.1 9.2,68.4 4.4,73.2 4.4,78.8 6,80.4 10.7,80.4 J1.1
  Top 0.813: J1.1 15.57,78.88 C13.2 18.57,78.88 C14.1
  Top 1.016: J1.1 14.1,77.4 U$11.1